# EasyEDA Pro project InOut Counter.eprj

# Schematic MainBoard
Board Name: PCB2; Create Date: 2026-01-17; Page Name: P1; Project Name: InOut Counter; Schematic Name: MainBoard; Update Date: 2026-01-24; Company: EasyEDA.com; Page Size: A4; Version: V1.0
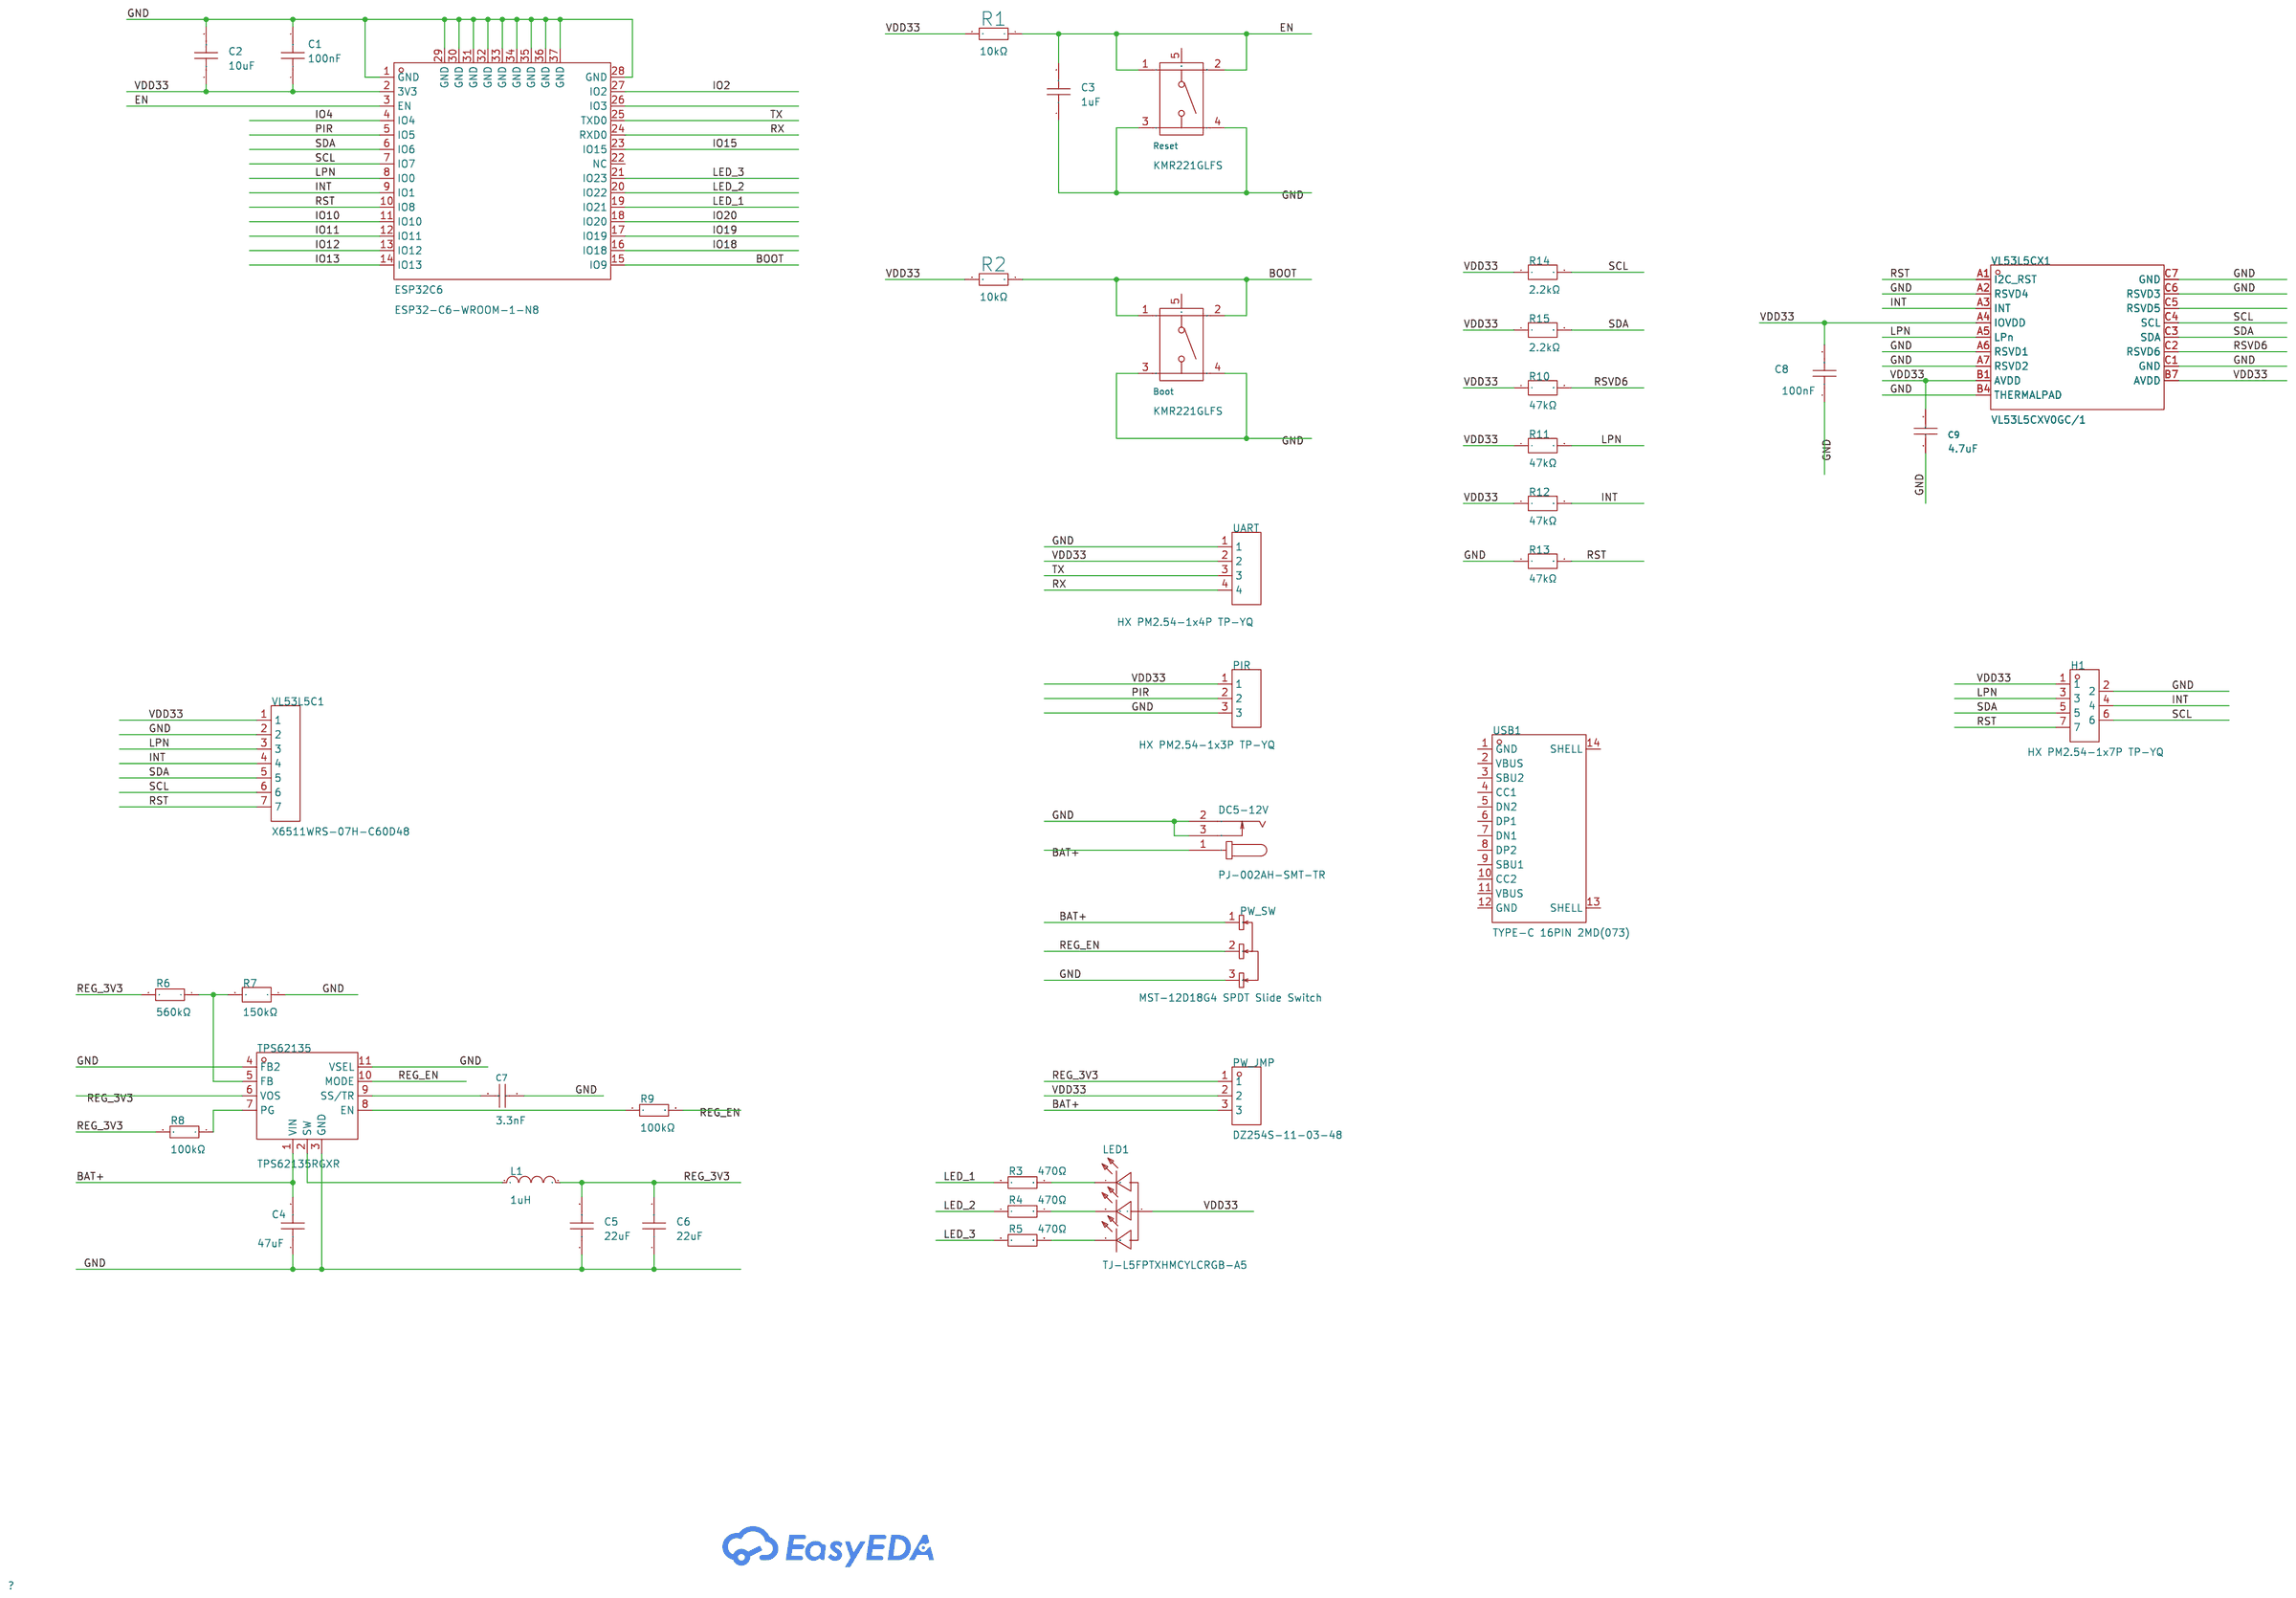
[diagram p0: schematic sheet]

## Parts
Boot  KMR221GLFS  [KEY-SMD_KMR2XXGXXX]
C1  100nF  [C0603]
C2  10uF  [C0603]
C3  1uF  [C0603]
C4  47uF  [C1206]
C5  22uF  [C0603]
C6  22uF  [C0603]
C7  3.3nF  [C0603]
C8  100nF  [C0603]
C9  4.7uF  [C0603]
DC5-12V  PJ-002AH-SMT-TR  [DC-IN-TH_PJ-002AH-SMT-TR]
ESP32C6  ESP32-C6-WROOM-1-N8  [WIRELM-SMD_ESP32-C6-WROOM-1]
H1  HX PM2.54-1x7P TP-YQ  [HDR-SMD_7P-P2.54_HX-PM2.54-1X7P-TP-YQ]
L1  1uH  [IND-SMD_L2.5-W2.0-VLS252012CX-150M]
LED1  TJ-L5FPTXHMCYLCRGB-A5  [LED-TH_4P-BD5.8-P1.30]
PIR  HX PM2.54-1x3P TP-YQ  [HDR-SMD_3P-P2.54-V-F_C9900045551]
PW_JMP  DZ254S-11-03-48  [HDR-TH_3P-P2.54_DZ254S-11-03-48]
PW_SW  MST-12D18G4 SPDT Slide Switch  [SW-SMD_MST-12D18G4-SPDT-SLIDE-SWITCH]
R1  10kΩ  [R0603]
R2  10kΩ  [R0603]
R3  470Ω  [R0603]
R4  470Ω  [R0603]
R5  470Ω  [R0603]
R6  560kΩ  [R0603]
R7  150kΩ  [R0603]
R8  100kΩ  [R0603]
R9  100kΩ  [R0603]
R10  47kΩ  [R0603]
R11  47kΩ  [R0603]
R12  47kΩ  [R0603]
R13  47kΩ  [R0603]
R14  2.2kΩ  [R0603]
R15  2.2kΩ  [R0603]
Reset  KMR221GLFS  [KEY-SMD_KMR2XXGXXX]
TPS62135  TPS62135RGXR  [VQFN-HR-11_L3.0-W2.0-P0.50_TPS62135RGXR]
UART  HX PM2.54-1x4P TP-YQ  [HDR-SMD_HX-PM2.54-1X4P-TP-YQ]
USB1  TYPE-C 16PIN 2MD(073)  [USB-C-SMD_TYPE-C-6PIN-2MD-073]
VL53L5C1  X6511WRS-07H-C60D48  [HDR-SMD_7P-P2.54-H-M-W13.3-N]
VL53L5CX1  VL53L5CXV0GC/1  [LGA-16_L6.4-W3.0_VL53L5CXV0GC-1]

## Library data of the parts
Boot Reset = KMR221GLFS: LCSC Part Name: 4.6*2.8*1.9mm 立贴 轻触开关; Supplier Part: C72443; Manufacturer: C&K; Supplier Footprint: SMD; JLCPCB Part Class: Extended Part; Datasheet: https://atta.szlcsc.com/upload/public/pdf/source/20181012/C265019_000848423B8E84768868498C37CC451B.pdf; Supplier: LCSC; Circuit: SPST; Actuator Style: Round Button; Operating Force: 200gf; Mounting Style: Brick nogging; Switch Length: 4.6mm; Switch Width: 2.8mm; Switch Height: 1.9mm; Contact Current: 50mA; Voltage Rating (DC): 32V; Pin Style: Gull Wing; Operating Temperature: -40℃~+85℃
C1 C8 = TCC0603X7R104K500CT: LCSC Part Name: 100nF ±10% 50V; Supplier Part: C282519; Manufacturer: CCTC(三环); Supplier Footprint: 0603; JLCPCB Part Class: Extended Part; Datasheet: https://item.szlcsc.com/datasheet/TCC0603X7R104K500CT/268639.html; Supplier: LCSC; Tolerance: ±10%; Voltage Rating: 50V; Temperature Coefficient: X7R
C2 = CL10A106MQ8NNNC: LCSC Part Name: 10uF ±20% 6.3V; Supplier Part: C1691; Manufacturer: SAMSUNG(三星); Supplier Footprint: 0603; JLCPCB Part Class: Extended Part; Datasheet: https://item.szlcsc.com/datasheet/CL10A106MQ8NNNC/2043.html; Supplier: LCSC; Tolerance: ±20%; Voltage Rating: 6.3V; Temperature Coefficient: X5R
C3 = CGA0603X5R105K500JT: LCSC Part Name: 1uF ±10% 50V; Supplier Part: C6119852; Manufacturer: HRE(芯声); Supplier Footprint: 0603; JLCPCB Part Class: Extended Part; Datasheet: https://item.szlcsc.com/datasheet/CGA0603X5R105K500JT/7062558.html; Supplier: LCSC; Tolerance: ±10%; Voltage Rating: 50V; Temperature Coefficient: X5R
C4 = GRM31CR61E476ME44L: LCSC Part Name: 47uF ±20% 25V; Supplier Part: C403725; Manufacturer: muRata(村田); Supplier Footprint: 1206; JLCPCB Part Class: Extended Part; Datasheet: https://item.szlcsc.com/datasheet/GRM31CR61E476ME44L/389810.html; Supplier: LCSC; Tolerance: ±20%; Voltage Rating: 25V; Temperature Coefficient: X5R
C5 C6 = CL10A226MQ8NRNC: LCSC Part Name: 22uF ±20% 6.3V; Supplier Part: C59461; Manufacturer: SAMSUNG(三星); Supplier Footprint: 0603; JLCPCB Part Class: Basic Part; Datasheet: https://item.szlcsc.com/datasheet/CL10A226MQ8NRNC/60514.html; Supplier: LCSC; Tolerance: ±20%; Voltage Rating: 6.3V; Temperature Coefficient: X5R
C7 = CC0603KRX7R9BB332: LCSC Part Name: 3.3nF ±10% 50V; Supplier Part: C107088; Manufacturer: YAGEO(国巨); Supplier Footprint: 0603; JLCPCB Part Class: Extended Part; Datasheet: https://item.szlcsc.com/datasheet/CC0603KRX7R9BB332/108304.html; Supplier: LCSC; Tolerance: ±10%; Voltage Rating: 50V; Temperature Coefficient: X7R
C9 = CL10A475KP8NNNC: LCSC Part Name: 4.7uF ±10% 10V; Supplier Part: C1705; Manufacturer: SAMSUNG(三星); Supplier Footprint: 0603; JLCPCB Part Class: Extended Part; Datasheet: https://item.szlcsc.com/datasheet/CL10A475KP8NNNC/2057.html; Supplier: LCSC; Tolerance: ±10%; Voltage Rating: 10V; Temperature Coefficient: X5R
DC5-12V = PJ-002AH-SMT-TR_C22434687: Supplier Part: C22434687; Manufacturer: CUI; Supplier Footprint: SMD; JLCPCB Part Class: Extended Part; Datasheet: https://atta.szlcsc.com/upload/public/pdf/source/20240806/E75BFBA62D498CDF6E8300B1DA029BA5.pdf; Supplier: LCSC
ESP32C6 = ESP32-C6-WROOM-1-N8: Supplier Part: C5366877; Manufacturer: ESPRESSIF(乐鑫); JLCPCB Part Class: Extended Part; Datasheet: https://item.szlcsc.com/datasheet/ESP32-C6-WROOM-1-N8/6203223.html; Supplier: LCSC
H1 = HX PM2.54-1x7P TP-YQ: LCSC Part Name: 1x7P 间距:2.54mm 立贴; Supplier Part: C42379199; Manufacturer: hanxia(韩下); Supplier Footprint: SMD,P=2.54mm(交错脚); JLCPCB Part Class: Extended Part; Datasheet: https://item.szlcsc.com/datasheet/HX%2520PM2.54-1x7P%2520TP-YQ/44285228.html; Supplier: LCSC; Holes Structure: 1x7P; Pitch: 2.54mm; Circular Hole / Square Hole: Square Hole; Mounting Type: Surface Mount,Vertical; Number of Rows: 1; Number of Positions: 7P; Current Rating: 3A; Voltage Rating (Max): 1kV; Holes Direction: Top; Insulation Height: 5mm; Contact Material: Brass; Contact Plating: Gold; Operating Temperature: -40℃~+105℃
L1 = VLS252012HBX-1R0M-1: LCSC Part Name: 1uH ±20% 3A; Supplier Part: C360732; Manufacturer: TDK; Supplier Footprint: 1008; JLCPCB Part Class: Extended Part; Datasheet: https://item.szlcsc.com/datasheet/VLS252012HBX-1R0M-1/335519.html; Supplier: LCSC; Tolerance: ±20%; Current Rating: 3A; Current - Saturation(Isat): 3A; DC Resistance(DCR): 47mΩ
LED1 = TJ-L5FPTXHMCYLCRGB-A5: Diode Configuration:Common Anode Wavelength - Dominant:B:460nm~470nm；G:515nm~530nm；R:620nm~630nm Peak Wavelength:R:620nm；G:520nm；B:465nm Luminous Intensity:R:100mcd~200mcd；B:100mcd~200mcd；G:400mcd~600mcd Lens Color:White Frosted Lens Forward Current:20mA; LCSC Part Name: 5MM平头共阳雾状RGB; Supplier Part: C20613339; Manufacturer: TOGIALED(统佳); Supplier Footprint: 插件; JLCPCB Part Class: Extended Part; Datasheet: https://item.szlcsc.com/datasheet/TJ-L5FPTXHMCYLCRGB-A5/21974274.html; Supplier: LCSC; Diode Configuration: Common Anode; Wavelength - Dominant: B:460nm~470nm；G:515nm~530nm；R:620nm~630nm; Peak Wavelength: R:620nm；G:520nm；B:465nm; Luminous Intensity: R:100mcd~200mcd；B:100mcd~200mcd；G:400mcd~600mcd; Lens Color: White Frosted Lens; Forward Current: 20mA; Forward Voltage(Vf): B:2.8V~3.6V；R:1.8V~2.6V；G:2.8V~3.6V; Power(Watts): 184mW; Operating Temperature: -20℃~+80℃; Lamp Holder Type: 5 mm flat-head LED; Pitch: 1.3mm
PIR = HX PM2.54-1x3P TP-YQ: LCSC Part Name: 1x3P 间距:2.54mm 立贴; Supplier Part: C42379196; Manufacturer: hanxia(韩下); Supplier Footprint: SMD,P=2.54mm(交错脚); JLCPCB Part Class: Extended Part; Datasheet: https://item.szlcsc.com/datasheet/HX%2520PM2.54-1x3P%2520TP-YQ/44285225.html; Supplier: LCSC; Holes Structure: 1x3P; Pitch: 2.54mm; Circular Hole / Square Hole: Square Hole; Mounting Type: Surface Mount,Vertical; Number of Rows: 1; Number of Positions: 3P; Current Rating: 3A; Voltage Rating (Max): 1kV; Holes Direction: Top; Insulation Height: 5mm; Contact Material: Brass; Contact Plating: Gold; Operating Temperature: -40℃~+105℃
PW_JMP = DZ254S-11-03-48: LCSC Part Name: 1x3P 间距:2.54mm 方针 立贴; Supplier Part: C5160786; Manufacturer: DEALON(德艺隆); Supplier Footprint: SMD,P=2.54mm(交错脚); JLCPCB Part Class: Extended Part; Datasheet: https://item.szlcsc.com/datasheet/DZ254S-11-03-48/5807882.html; Supplier: LCSC; Pin Structure: 1x3P; Pitch: 2.54mm; Circluar Pins/Square Pins: Pin Header; Mounting Type: Surface Mount,Vertical; Number of Rows: 1; Number of Pins: 3P; Current Rating: 3A; Length of Mating Pin: 6mm; Insulation Height: 2.54mm; Contact Material: Brass; Contact Plating: Gold; Color: Black
PW_SW = MST-12D18G4 SPDT Slide Switch: LCSC Part Name: MST-12D18G4卧式带柱编带; Supplier Part: C49023767; Manufacturer: SHOU HAN(首韩); Supplier Footprint: SMD; JLCPCB Part Class: Extended Part; Datasheet: https://item.szlcsc.com/datasheet/MST-12D18G4%2520SPDT%2520Slide%2520Switch/51384142.html; Supplier: LCSC; Circuit: SPDT; Actuator Style: Rectangular Columnar; Termination Style: SMD(SMT) Tab; Length: 9.1mm; Width: 3.5mm; Switch Height: 7.5mm; Mounting Type: Surface Mount, Right Angle; Actuator Color: Black; Current Rating: 100mA; Voltage Rating: 12V; Life: 10,000 Cycles; Operating Temperature: -25℃~+70℃
R1 R2 = 0603WAF1002T5E: LCSC Part Name: 厚膜电阻 10kΩ ±1% 100mW; Supplier Part: C25804; Manufacturer: UNI-ROYAL(厚声); Supplier Footprint: 0603; JLCPCB Part Class: Basic Part; Datasheet: https://item.szlcsc.com/datasheet/0603WAF1002T5E/26547.html; Supplier: LCSC; Type: Thick Film Resistor; Tolerance: ±1%; Power(Watts): 100mW; Voltage-Supply(Max): 75V; Temperature Coefficient: ±100ppm/℃; Operating Temperature: -55℃~+155℃
R3-R5 = 0603WAF4700T5E: LCSC Part Name: 470Ω ±1% 100mW 厚膜电阻; Supplier Part: C23179; Manufacturer: UNI-ROYAL(厚声); Supplier Footprint: 0603; JLCPCB Part Class: Basic Part; Datasheet: https://item.szlcsc.com/datasheet/0603WAF4700T5E/23906.html; Supplier: LCSC; Type: Thick Film Resistor; Tolerance: ±1%; Power(Watts): 100mW; Voltage-Supply(Max): 75V; Temperature Coefficient: ±100ppm/℃; Operating Temperature: -55℃~+155℃
R6 = 0603WAF5603T5E: LCSC Part Name: 560kΩ ±1% 100mW 厚膜电阻; Supplier Part: C23203; Manufacturer: UNI-ROYAL(厚声); Supplier Footprint: 0603; JLCPCB Part Class: Extended Part; Datasheet: https://item.szlcsc.com/datasheet/0603WAF5603T5E/23930.html; Supplier: LCSC; Type: Thick Film Resistor; Tolerance: ±1%; Power(Watts): 100mW; Voltage-Supply(Max): 75V; Temperature Coefficient: ±100ppm/℃; Operating Temperature: -55℃~+155℃
R7 = FRC0603F1503TS: LCSC Part Name: 150kΩ ±1% 100mW 厚膜电阻; Supplier Part: C2906993; Manufacturer: FOJAN(富捷); Supplier Footprint: 0603; JLCPCB Part Class: Extended Part; Supplier: LCSC; Type: Thick Film Resistor; Tolerance: ±1%; Power(Watts): 100mW; Voltage-Supply(Max): 75V; Temperature Coefficient: ±100ppm/℃; Operating Temperature: -55℃~+155℃
R8 R9 = 0603WAF1003T5E: LCSC Part Name: 100kΩ ±1% 100mW 厚膜电阻; Supplier Part: C25803; Manufacturer: UNI-ROYAL(厚声); Supplier Footprint: 0603; JLCPCB Part Class: Basic Part; Datasheet: https://item.szlcsc.com/datasheet/0603WAF1003T5E/26546.html; Supplier: LCSC; Type: Thick Film Resistor; Tolerance: ±1%; Power(Watts): 100mW; Voltage-Supply(Max): 75V; Temperature Coefficient: ±100ppm/℃; Operating Temperature: -55℃~+155℃
R10-R13 = FRC0603F4702TS: LCSC Part Name: 47kΩ ±1% 100mW 厚膜电阻; Supplier Part: C2907042; Manufacturer: FOJAN(富捷); Supplier Footprint: 0603; JLCPCB Part Class: Extended Part; Supplier: LCSC; Type: Thick Film Resistor; Tolerance: ±1%; Power(Watts): 100mW; Voltage-Supply(Max): 75V; Temperature Coefficient: ±100ppm/℃; Operating Temperature: -55℃~+155℃
R14 R15 = FRC0603J222 TS: LCSC Part Name: 2.2kΩ ±5% 100mW 厚膜电阻; Supplier Part: C2907117; Manufacturer: FOJAN(富捷); Supplier Footprint: 0603; JLCPCB Part Class: Extended Part; Supplier: LCSC; Type: Thick Film Resistor; Tolerance: ±5%; Power(Watts): 100mW; Voltage-Supply(Max): 75V; Temperature Coefficient: ±100ppm/℃; Operating Temperature: -55℃~+155℃
TPS62135 = TPS62135RGXR: LCSC Part Name: 高精度3V至17V 4A降压转换器; Supplier Part: C167238; Manufacturer: TI(德州仪器); Supplier Footprint: VQFN-11-HR(2x3); JLCPCB Part Class: Extended Part; Datasheet: https://www.ti.com/cn/lit/gpn/tps62135; Supplier: LCSC; Function: Step-down type; Output Type: Adjustable; Input Voltage: 3V~17V; Output Voltage: 800mV~12V; Output Current: 4A; Switching Frequency: 2.5MHz; Operating Temperature: -40℃~+125℃; Synchronous Rectification: Yes; Number of Outputs: 1; Topology: Step-down; Quiescent Current (Iq): 18uA; Switch tube (built-in/external): Built-in
UART = HX PM2.54-1x4P TP-YQ: LCSC Part Name: 1x4P 间距:2.54mm 立贴; Supplier Part: C42379197; Manufacturer: hanxia(韩下); Supplier Footprint: SMD,P=2.54mm(交错脚); JLCPCB Part Class: Extended Part; Datasheet: https://item.szlcsc.com/datasheet/HX%2520PM2.54-1x4P%2520TP-YQ/44285226.html; Supplier: LCSC; Holes Structure: 1x4P; Pitch: 2.54mm; Circular Hole / Square Hole: Square Hole; Mounting Type: Surface Mount,Vertical; Number of Rows: 1; Number of Positions: 4P; Current Rating: 3A; Voltage Rating (Max): 1kV; Holes Direction: Top; Insulation Height: 5mm; Contact Material: Brass; Contact Plating: Gold; Operating Temperature: -40℃~+105℃
USB1 = TYPE-C 16PIN 2MD(073): LCSC Part Name: 16P卧贴母座; Supplier Part: C2765186; Manufacturer: SHOU HAN(首韩); Supplier Footprint: SMD; JLCPCB Part Class: Extended Part; Datasheet: https://item.szlcsc.com/datasheet/TYPE-C%252016PIN%25202MD(073)/2901843.html; Supplier: LCSC; Connector Type: Type-C; Gender: Female; Mounting Type: Surface Mount, Right Angle; Number of Contacts: 16P; Number of Ports: 1; Current Rating-Power: 3A; Voltage Rating: 5V; Connect-Disconnect Life: 5,000 times; Detection color: Black; Operating Temperature: -25℃~+85℃
VL53L5C1 = X6511WRS-07H-C60D48: LCSC Part Name: 1x7P 间距:2.54mm 方针; Supplier Part: C5242200; Manufacturer: XKB Connection(中国星坤); Supplier Footprint: SMD,P=2.54mm; JLCPCB Part Class: Extended Part; Datasheet: https://atta.szlcsc.com/upload/public/pdf/source/20221103/EADF72CF36CD96D511D8188ACEE72315.pdf; Supplier: LCSC; Pin Structure: 1x7P; Pitch: 2.54mm; Row Spacing: 2.54mm; Circluar Pins/Square Pins: Policy; Number of Rows: Single Row; Number of Pins: 7P; Current Rating: 3A; Voltage Rating (Max): 250V; Insulation Height: 2.5mm; Contact Material: Brass; Contact Plating: Gold; Operating Temperature: -40℃~+105℃; Color: Black
VL53L5CX1 = VL53L5CXV0GC/1: LCSC Part Name: I2C接口的飞行时间多区测距传感器; Supplier Part: C3178303; Manufacturer: ST(意法半导体); Supplier Footprint: SMD,6.4x3mm; JLCPCB Part Class: Extended Part; Datasheet: https://item.szlcsc.com/datasheet/VL53L5CXV0GC%252F1/3740241.html; Supplier: LCSC; Voltage - Supply: 2.8V~3.3V; Linear Range: 4m

## Nets
GND: Boot.3 Boot.4 C1.2 C2.2 C3.1 C4.1 C5.1 C6.1 C7.2 C8.1 C9.1 DC5-12V.2 DC5-12V.3 ESP32C6.1(GND) ESP32C6.28(GND) ESP32C6.29(GND) ESP32C6.30(GND) ESP32C6.31(GND) ESP32C6.32(GND) ESP32C6.33(GND) ESP32C6.34(GND) ESP32C6.35(GND) ESP32C6.36(GND) ESP32C6.37(GND) H1.2 PIR.3 PW_SW.3 R7.1 R13.1 Reset.3 Reset.4 TPS62135.3(GND) TPS62135.4(FB2) TPS62135.11(VSEL) UART.1 VL53L5C1.2 VL53L5CX1.A2(RSVD4) VL53L5CX1.A6(RSVD1) VL53L5CX1.A7(RSVD2) VL53L5CX1.B4(THERMALPAD) VL53L5CX1.C1(GND) VL53L5CX1.C6(RSVD3) VL53L5CX1.C7(GND)
VDD33: C1.1 C2.1 C8.2 C9.2 ESP32C6.2(3V3) H1.1 LED1.1 PIR.1 PW_JMP.2 R1.2 R2.2 R10.1 R11.1 R12.1 R14.1 R15.1 UART.2 VL53L5C1.1 VL53L5CX1.A4(IOVDD) VL53L5CX1.B1(AVDD) VL53L5CX1.B7(AVDD)
BAT+: C4.2 DC5-12V.1 PW_JMP.3 PW_SW.1 TPS62135.1(VIN)
BOOT: Boot.1 Boot.2 ESP32C6.15(IO9) R2.1
EN: C3.2 ESP32C6.3(EN) R1.1 Reset.1 Reset.2
INT: ESP32C6.9(IO1) H1.4 R12.2 VL53L5C1.4 VL53L5CX1.A3(INT)
IO2: ESP32C6.27(IO2)
IO4: ESP32C6.4(IO4)
IO10: ESP32C6.11(IO10)
IO11: ESP32C6.12(IO11)
IO12: ESP32C6.13(IO12)
IO13: ESP32C6.14(IO13)
IO15: ESP32C6.23(IO15)
IO18: ESP32C6.16(IO18)
IO19: ESP32C6.17(IO19)
IO20: ESP32C6.18(IO20)
LED_1: ESP32C6.19(IO21) R3.1
LED_2: ESP32C6.20(IO22) R4.1
LED_3: ESP32C6.21(IO23) R5.1
LPN: ESP32C6.8(IO0) H1.3 R11.2 VL53L5C1.3 VL53L5CX1.A5(LPn)
PIR: ESP32C6.5(IO5) PIR.2
REG_3V3: C5.2 C6.2 L1.2 PW_JMP.1 R6.2 R8.2 TPS62135.6(VOS)
REG_EN: PW_SW.2 R9.2 TPS62135.10(MODE)
RST: ESP32C6.10(IO8) H1.7 R13.2 VL53L5C1.7 VL53L5CX1.A1(I2C_RST)
RSVD6: R10.2 VL53L5CX1.C2(RSVD6)
RX: ESP32C6.24(RXD0) UART.4
SCL: ESP32C6.7(IO7) H1.6 R14.2 VL53L5C1.6 VL53L5CX1.C4(SCL)
SDA: ESP32C6.6(IO6) H1.5 R15.2 VL53L5C1.5 VL53L5CX1.C3(SDA)
TX: ESP32C6.25(TXD0) UART.3
$1N2759: L1.1 TPS62135.2(SW)
$1N2973: R8.1 TPS62135.7(PG)
$1N3037: R9.1 TPS62135.8(EN)
$1N3194: R6.1 R7.2 TPS62135.5(FB)
$1N3307: C7.1 TPS62135.9(SS/TR)
$1N5772: LED1.4(R) R3.2
$1N5776: LED1.3(G) R4.2
$1N5784: LED1.2(B) R5.2

Not connected (* = marked no-connect by the designer): Boot 5; ESP32C6 22(NC) 26(IO3); Reset 5; USB1 1(GND) 2(VBUS) 3(SBU2) 4(CC1) 5(DN2) 6(DP1) 7(DN1) 8(DP2) 9(SBU1) 10(CC2) 11(VBUS) 12(GND) 13(SHELL) 14(SHELL); VL53L5CX1 C5(RSVD5)

# Schematic DaughterBoard
Board Name: Board1; Create Date: 2026-01-23; Page Name: P1; Project Name: InOut Counter; Schematic Name: DaughterBoard; Update Date: 2026-01-23; Company: EasyEDA.com; Page Size: A4; Version: V1.0
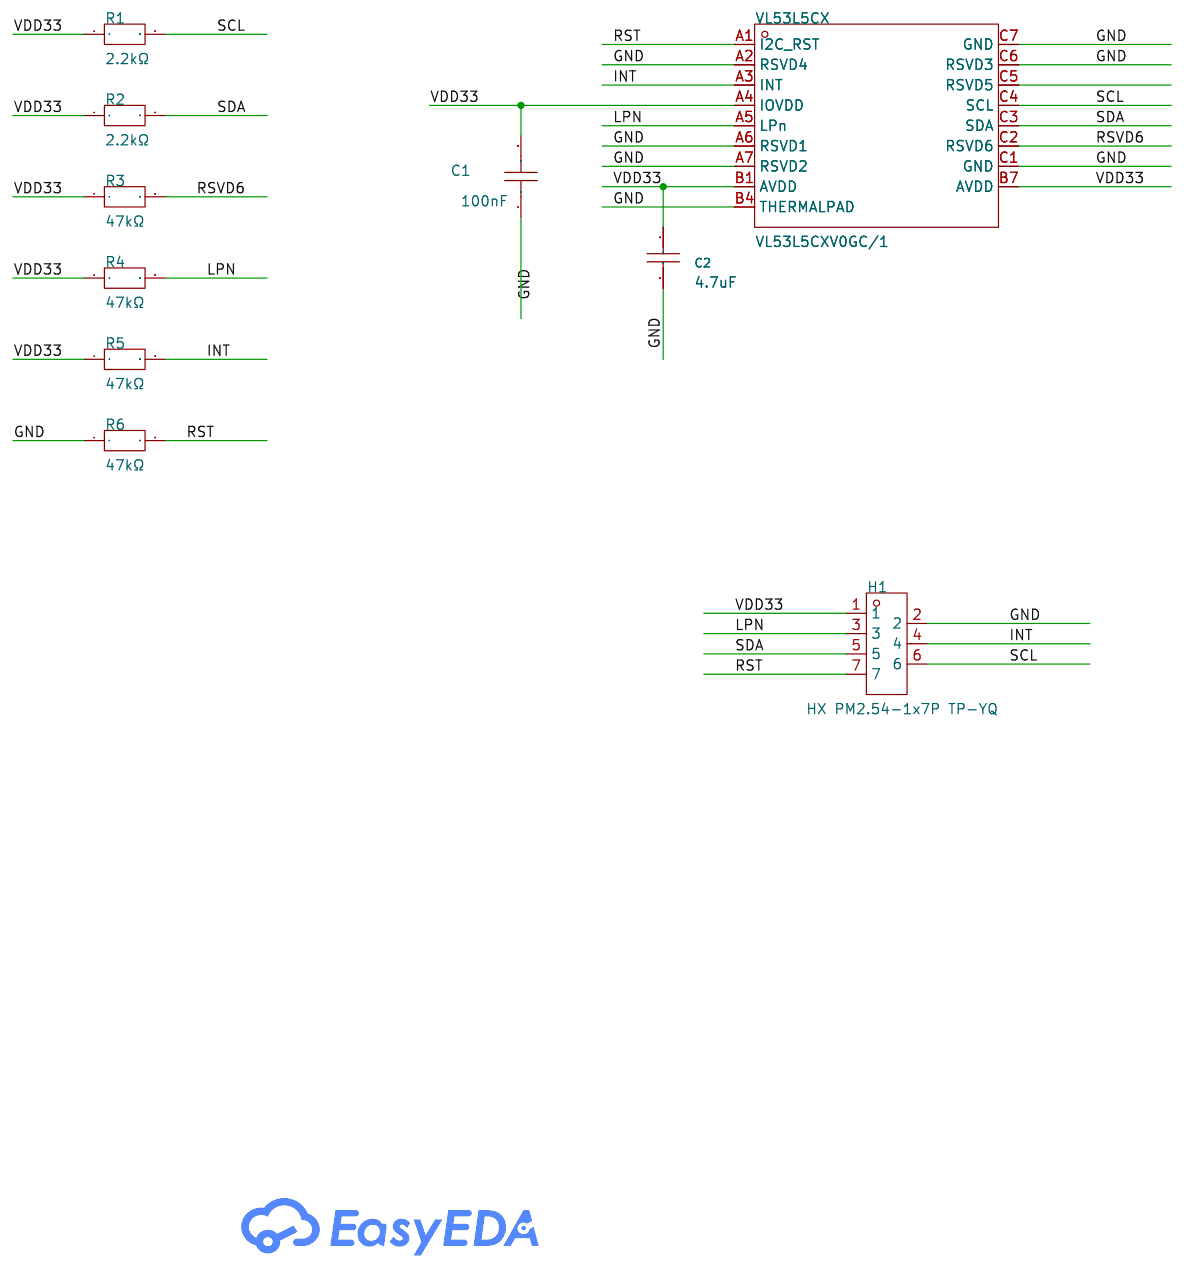
[diagram p1: schematic sheet]

## Parts
C1  100nF  [C0603]
C2  4.7uF  [C0603]
H1  HX PM2.54-1x7P TP-YQ  [HDR-SMD_7P-P2.54_HX-PM2.54-1X7P-TP-YQ]
R1  2.2kΩ  [R0603]
R2  2.2kΩ  [R0603]
R3  47kΩ  [R0603]
R4  47kΩ  [R0603]
R5  47kΩ  [R0603]
R6  47kΩ  [R0603]
VL53L5CX  VL53L5CXV0GC/1  [LGA-16_L6.4-W3.0_VL53L5CXV0GC-1]

## Library data of the parts
C1 = TCC0603X7R104K500CT: LCSC Part Name: 100nF ±10% 50V; Supplier Part: C282519; Manufacturer: CCTC(三环); Supplier Footprint: 0603; JLCPCB Part Class: Extended Part; Datasheet: https://item.szlcsc.com/datasheet/TCC0603X7R104K500CT/268639.html; Supplier: LCSC; Tolerance: ±10%; Voltage Rating: 50V; Temperature Coefficient: X7R
C2 = CL10A475KP8NNNC: LCSC Part Name: 4.7uF ±10% 10V; Supplier Part: C1705; Manufacturer: SAMSUNG(三星); Supplier Footprint: 0603; JLCPCB Part Class: Extended Part; Datasheet: https://item.szlcsc.com/datasheet/CL10A475KP8NNNC/2057.html; Supplier: LCSC; Tolerance: ±10%; Voltage Rating: 10V; Temperature Coefficient: X5R
H1 = HX PM2.54-1x7P TP-YQ: LCSC Part Name: 1x7P 间距:2.54mm 立贴; Supplier Part: C42379199; Manufacturer: hanxia(韩下); Supplier Footprint: SMD,P=2.54mm(交错脚); JLCPCB Part Class: Extended Part; Datasheet: https://item.szlcsc.com/datasheet/HX%2520PM2.54-1x7P%2520TP-YQ/44285228.html; Supplier: LCSC; Holes Structure: 1x7P; Pitch: 2.54mm; Circular Hole / Square Hole: Square Hole; Mounting Type: Surface Mount,Vertical; Number of Rows: 1; Number of Positions: 7P; Current Rating: 3A; Voltage Rating (Max): 1kV; Holes Direction: Top; Insulation Height: 5mm; Contact Material: Brass; Contact Plating: Gold; Operating Temperature: -40℃~+105℃
R1 R2 = FRC0603J222 TS: LCSC Part Name: 2.2kΩ ±5% 100mW 厚膜电阻; Supplier Part: C2907117; Manufacturer: FOJAN(富捷); Supplier Footprint: 0603; JLCPCB Part Class: Extended Part; Supplier: LCSC; Type: Thick Film Resistor; Tolerance: ±5%; Power(Watts): 100mW; Voltage-Supply(Max): 75V; Temperature Coefficient: ±100ppm/℃; Operating Temperature: -55℃~+155℃
R3-R6 = FRC0603F4702TS: LCSC Part Name: 47kΩ ±1% 100mW 厚膜电阻; Supplier Part: C2907042; Manufacturer: FOJAN(富捷); Supplier Footprint: 0603; JLCPCB Part Class: Extended Part; Supplier: LCSC; Type: Thick Film Resistor; Tolerance: ±1%; Power(Watts): 100mW; Voltage-Supply(Max): 75V; Temperature Coefficient: ±100ppm/℃; Operating Temperature: -55℃~+155℃
VL53L5CX = VL53L5CXV0GC/1: LCSC Part Name: I2C接口的飞行时间多区测距传感器; Supplier Part: C3178303; Manufacturer: ST(意法半导体); Supplier Footprint: SMD,6.4x3mm; JLCPCB Part Class: Extended Part; Datasheet: https://item.szlcsc.com/datasheet/VL53L5CXV0GC%252F1/3740241.html; Supplier: LCSC; Voltage - Supply: 2.8V~3.3V; Linear Range: 4m

## Nets
GND: C1.1 C2.1 H1.2 R6.1 VL53L5CX.A2(RSVD4) VL53L5CX.A6(RSVD1) VL53L5CX.A7(RSVD2) VL53L5CX.B4(THERMALPAD) VL53L5CX.C1(GND) VL53L5CX.C6(RSVD3) VL53L5CX.C7(GND)
VDD33: C1.2 C2.2 H1.1 R1.1 R2.1 R3.1 R4.1 R5.1 VL53L5CX.A4(IOVDD) VL53L5CX.B1(AVDD) VL53L5CX.B7(AVDD)
INT: H1.4 R5.2 VL53L5CX.A3(INT)
LPN: H1.3 R4.2 VL53L5CX.A5(LPn)
RST: H1.7 R6.2 VL53L5CX.A1(I2C_RST)
RSVD6: R3.2 VL53L5CX.C2(RSVD6)
SCL: H1.6 R1.2 VL53L5CX.C4(SCL)
SDA: H1.5 R2.2 VL53L5CX.C3(SDA)

Not connected (* = marked no-connect by the designer): VL53L5CX C5(RSVD5)

# Board PCB1
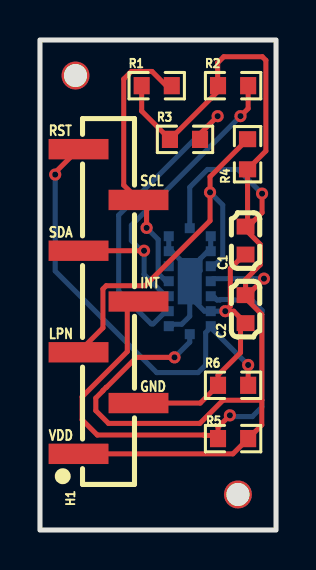
[diagram p2: board, top side]
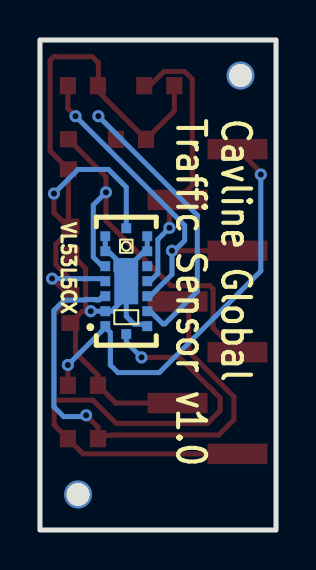
[diagram p3: board, bottom side, seen from below]

Outline 11.81 x 24.51 mm; copper layers: Top Layer, Bottom Layer. Coordinates in mm from the lower left corner of the outline.
Outline path: rectangle 0,24.51 11.81,0
Stack: Top Layer 0.035mm / Dielectric1 1.51mm FR4 er 4.5 / Bottom Layer 0.035mm

## Design rules (mm)
template: JLCPCB Capability(Two Layers Board)
spacing copperThickness1oz (default): track to track 0.102, other pairs 0.152 to 0.3
spacing copperThickness2oz: track to track 0.203, other pairs 0.152 to 0.3
track width copperThickness1oz (default): min 0.127, default 0.254, max 2.54
track width copperThickness2oz: min 0.203, default 0.254, max 2.54
differential pair differentialPair (default): width min 0.127, default 0.254, max 2.54; gap min 0.152, default 0.152
via viaSize (default): diameter min 0.5, default 0.61, max 10; hole min 0.3, default 0.305, max 6.3

## Placement (name value [footprint] x y rotation side)
C1  100nF  [C0603]  10.29 14.48 90 top
C2  4.7uF  [C0603]  10.29 11.05 90 top
H1  HX PM2.54-1x7P TP-YQ  [HDR-SMD_7P-P2.54_HX-PM2.54-1X7P-TP-YQ]  3.43 11.43 90 top
NOREF  -  [Pad_e10]  9.91 1.78 0 top
NOREF#2  -  [Pad_e0]  1.78 22.73 0 top
R1  2.2kΩ  [R0603]  5.84 22.22 0 top
R2  2.2kΩ  [R0603]  9.66 22.22 0 top
R3  47kΩ  [R0603]  7.26 19.54 0 top
R4  47kΩ  [R0603]  10.39 18.8 90 top
R5  47kΩ  [R0603]  9.66 4.57 180 top
R6  47kΩ  [R0603]  9.66 7.24 0 top
VL53L5CX  VL53L5CXV0GC/1  [LGA-16_L6.4-W3.0_VL53L5CXV0GC-1]  7.49 12.45 270 bottom

## Footprints (pads in the part's own frame, mm; a bottom-side part is the same pattern mirrored in y, then rotated)
C0603
  rect 0.8x0.9 smd: 1(-0.7,0) 2(0.7,0)
HDR-SMD_7P-P2.54_HX-PM2.54-1X7P-TP-YQ
  rect 1.02x3 smd: 1(-7.62,1.5) 2(-5.08,-1.5) 3(-2.54,1.5) 4(0,-1.5) 5(2.54,1.5) 6(5.08,-1.5) 7(7.62,1.5)
LGA-16_L6.4-W3.0_VL53L5CXV0GC-1
  rect 0.5x0.5 smd: A1(2.25,-1.05) A2(1.5,-1.05) A3(0.75,-1.05) A4(0,-1.05) A5(-0.75,-1.05) A6(-1.5,-1.05) A7(-2.25,-1.05) B1(2.65,0) B7(-2.65,0) C1(2.25,1.05) C2(1.5,1.05) C3(0.75,1.05) C4(0,1.05) C5(-0.75,1.05) C6(-1.5,1.05) C7(-2.25,1.05)
  rect 2.316x1.2 smd: B4(0,0)
Pad_e0
  round 1.4 hole 1.152: 1(0,0)
Pad_e10
  round 1.4 hole 1.152: 2(0,0)
R0603
  rect 0.806x0.864 smd: 1(-0.753,0) 2(0.753,0)

## Nets
As in the schematic.

Pads without a net: NOREF 2; NOREF#2 1

## Via types
v1: diameter 0.61, hole 0.305, Top Layer to Bottom Layer, 12 vias

## Routing (per net, layer and track width the routed paths; a pad name or vN(x,y) marks a point on that pad's centre or on a via; arc(x,y) is an arc through that point)
GND: length 23.2
  Top Layer w0.254: H1.2 8.02,6.35 8.91,7.24 8.91,7.75 10.03,8.87 10.03,10.09 C2.1 9.69,10.95 v1(9.27,10.95) 9.53,11.2 9.53,13.08 10.22,13.78 C1.1
  Bottom Layer w0.254: VL53L5CX.B4 8.01,12.97 8.01,13.56 8.4,13.95 VL53L5CX.A6 VL53L5CX.A7 ; VL53L5CX.B4 7.49,12.9 7.24,13.15 7.24,13.3 6.59,13.95 6.44,13.95 6.44,14.7 ; VL53L5CX.B4 7.49,11.68 ; 7.49,11.68 8.23,10.95 VL53L5CX.A2 v1(9.27,10.95) ; 7.49,11.68 7.49,10.69 7.09,10.29 6.66,10.29 6.57,10.2 6.44,10.2
VDD33: length 68.6
  Top Layer w0.254: C2.2 10.38,11.75 v1(11.21,12.57) ; C2.2 10.29,12.53 11.02,13.26 11.02,14.29 10.29,15.02 C1.2 ; C2.2 10.29,11.59 11.1,10.78 11.1,6.49 ; R1.1 5.09,20.95 R3.1 8.91,21.95 8.91,22.22 8.89,22.24 8.89,23.37 9.2,23.67 11.12,23.67 11.3,23.49 11.3,18.96 R4.1 10.39,15.28 C1.2 ; C1.2 10.42,15.18 11.11,15.88 v1(11.11,16.83) ; 11.1,6.49 9.16,6.49 8,5.33 3.43,5.33 2.79,5.97 2.79,6.6 3.15,6.96 3.15,6.98 3.31,7.14 3.33,7.14 4.83,8.64 v1(6.73,8.64) ; 11.1,6.49 11.1,5.25 R5.1 9.65,3.81 1.93,3.81
  Bottom Layer w0.254: v1(6.73,8.64) 7.49,9.4 VL53L5CX.B1 ; v1(11.21,12.57) 8.67,12.57 VL53L5CX.A4 ; v1(11.11,16.83) 9.91,18.03 8.38,18.03 7.49,17.14 7.49,15.1
INT: length 25.3
  Top Layer w0.254: H1.4 4.7,11.43 4.37,11.1 4.37,8.92 2.11,6.66 2.11,5.51 2.87,4.75 8.2,4.75 8.22,4.73 8.58,4.73 8.66,4.81 8.91,4.81 ; 8.91,4.81 8.91,4.57 ; 8.91,4.81 8.91,5.14 v1(9.5,5.74)
  Bottom Layer w0.254: VL53L5CX.A3 8.61,11.63 8.73,11.63 8.86,11.51 9,11.51 9.03,11.53 9.51,11.53 9.54,11.51 10.59,11.51 11.11,10.99 11.11,6.16 10.63,5.67 9.57,5.67 v1(9.5,5.74)
LPN: length 19.6
  Top Layer w0.254: 1.93,8.89 3.15,10.11 3.15,12.06 3.31,12.22 5.26,12.22 8.51,15.47 v1(8.51,16.89) 8.51,17.67 R4.2
  Bottom Layer w0.254: VL53L5CX.A5 8.69,13.2 9.14,13.65 9.14,16.26 v1(8.51,16.89)
RST: length 22.1
  Top Layer w0.254: v1(0.76,17.78) 0.76,17.88 H1.7 ; R6.2 v1(10.42,8.25)
  Bottom Layer w0.254: v1(10.42,8.25) 8.54,10.13 ; 8.54,10.13 VL53L5CX.A1 ; 8.54,10.13 8.29,9.87 8.29,8.25 7.91,7.87 5.84,7.87 0.76,12.95 v1(0.76,17.78)
RSVD6: length 15.8
  Top Layer w0.254: R3.2 8.01,19.82 v1(8.89,20.7)
  Bottom Layer w0.254: v1(8.89,20.7) 3.94,15.75 3.94,11.94 5.56,10.31 5.66,10.31 6.3,10.95 6.44,10.95
SCL: length 14
  Top Layer w0.254: R1.2 6.32,22.22 5.61,22.94 4.57,22.94 4.19,22.56 4.19,17.25 H1.6 5.33,16.1 v1(5.33,15.11)
  Bottom Layer w0.254: 6.44,12.45 6.3,12.45 5.91,12.83 5.91,14.53 v1(5.33,15.11)
SDA: length 17.2
  Top Layer w0.254: R2.2 10.42,21.08 v1(10.03,20.7) ; H1.5 v1(5.21,13.97)
  Bottom Layer w0.254: v1(10.03,20.7) 4.57,15.24 4.57,14.48 5.08,13.97 v1(5.21,13.97) 5.21,12.79 6.3,11.7 6.44,11.7

## Text on the board
Bottom Silkscreen Layer: Cavline Global / Traffic Sensor v1.0
Top Silkscreen Layer: RST | SDA | LPN | VDD | SCL | INT | GND

# Board PCB2
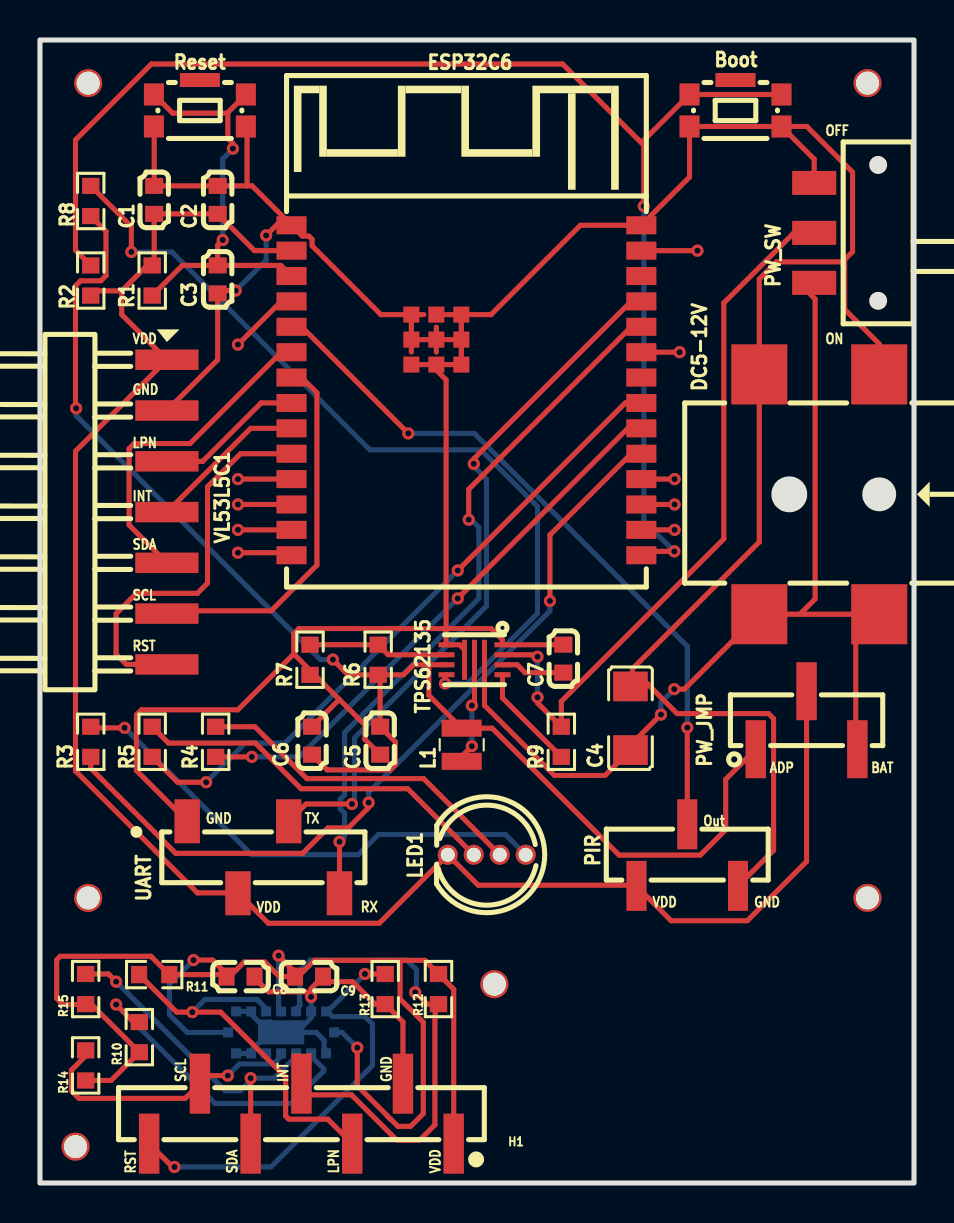
[diagram p4: board, top side]
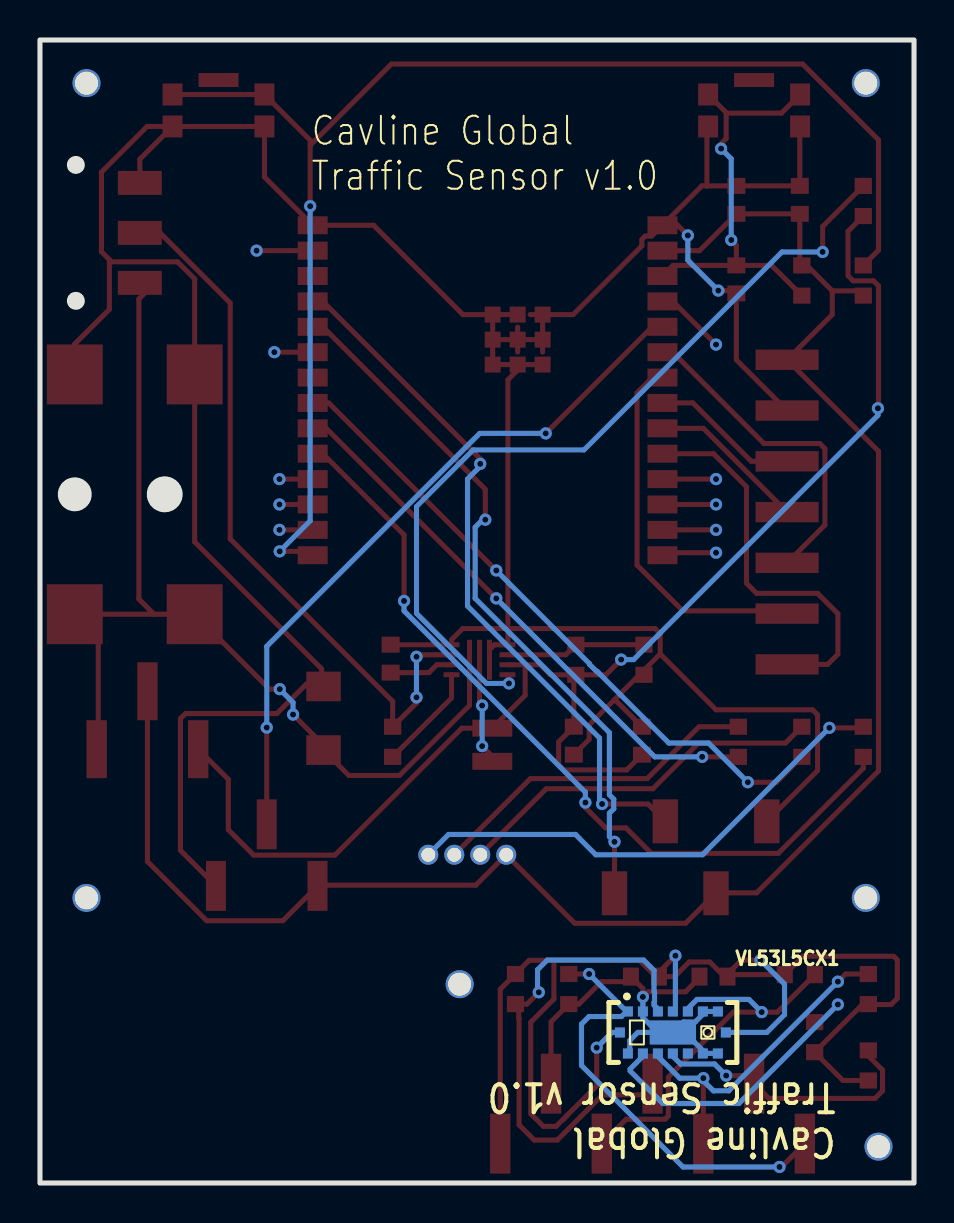
[diagram p5: board, bottom side, seen from below]

Outline 43.73 x 57.19 mm; copper layers: Top Layer, Bottom Layer. Coordinates in mm from the lower left corner of the outline.
Outline path: rectangle 0,57.19 43.73,0
Stack: Top Layer 0.035mm / Dielectric1 1.51mm FR4 er 4.5 / Bottom Layer 0.035mm

## Design rules (mm)
template: JLCPCB Capability(Two Layers Board)
spacing copperThickness1oz (default): track to track 0.102, other pairs 0.152 to 0.3
spacing copperThickness2oz: track to track 0.203, other pairs 0.152 to 0.3
track width copperThickness1oz (default): min 0.127, default 0.254, max 2.54
track width copperThickness2oz: min 0.203, default 0.254, max 2.54
differential pair differentialPair (default): width min 0.127, default 0.254, max 2.54; gap min 0.152, default 0.152
via viaSize (default): diameter min 0.5, default 0.61, max 10; hole min 0.3, default 0.305, max 6.3

## Placement (name value [footprint] x y rotation side)
Boot  KMR221GLFS  [KEY-SMD_KMR2XXGXXX]  34.8 54.03 0 top
C1  100nF  [C0603]  5.72 49.19 90 top
C2  10uF  [C0603]  8.89 49.19 90 top
C3  1uF  [C0603]  8.89 45.21 90 top
C4  47uF  [C1206]  29.54 23.26 270 top
C5  22uF  [C0603]  17.02 22.13 90 top
C6  22uF  [C0603]  13.61 22.13 270 top
C7  3.3nF  [C0603]  26.18 26.24 90 top
C8  100nF  [C0603]  10.03 10.33 180 top
C9  4.7uF  [C0603]  13.46 10.33 180 top
DC5-12V  PJ-002AH-SMT-TR  [DC-IN-TH_PJ-002AH-SMT-TR]  38.99 34.46 180 top
ESP32C6  ESP32-C6-WROOM-1-N8  [WIRELM-SMD_ESP32-C6-WROOM-1]  21.34 39.67 0 top
H1  HX PM2.54-1x7P TP-YQ  [HDR-SMD_7P-P2.54_HX-PM2.54-1X7P-TP-YQ]  13.08 3.47 180 top
L1  1uH  [IND-SMD_L2.5-W2.0-VLS252012CX-150M]  21.1 21.93 90 top
LED1  TJ-L5FPTXHMCYLCRGB-A5  [LED-TH_4P-BD5.8-P1.30]  22.35 16.43 180 top
NOREF  -  [Pad_e36]  41.4 14.27 0 top
NOREF#2  -  [Pad_e31]  41.4 55.03 0 top
NOREF#3  -  [Pad_e259]  22.73 9.95 90 top
NOREF#4  -  [Pad_e35]  2.41 55.03 0 top
NOREF#5  -  [Pad_e37]  2.41 14.27 0 top
NOREF#6  -  [Pad_e258]  1.78 1.82 90 top
PIR  HX PM2.54-1x3P TP-YQ  [HDR-SMD_3P-P2.54-V-F_C9900045551]  32.39 16.41 0 top
PW_JMP  DZ254S-11-03-48  [HDR-TH_3P-P2.54_DZ254S-11-03-48]  38.35 23.16 0 top
PW_SW  MST-12D18G4 SPDT Slide Switch  [SW-SMD_MST-12D18G4-SPDT-SLIDE-SWITCH]  38.74 47.54 90 top
R1  10kΩ  [R0603]  5.61 45.16 90 top
R2  10kΩ  [R0603]  2.54 45.16 270 top
R3  470Ω  [R0603]  2.54 22.08 90 top
R4  470Ω  [R0603]  8.79 22.08 90 top
R5  470Ω  [R0603]  5.61 22.08 90 top
R6  560kΩ  [R0603]  16.92 26.18 270 top
R7  150kΩ  [R0603]  13.51 26.18 90 top
R8  100kΩ  [R0603]  2.54 49.14 270 top
R9  100kΩ  [R0603]  26.08 22.08 90 top
R10  47kΩ  [R0603]  4.97 7.3 90 top
R11  47kΩ  [R0603]  5.72 10.43 180 top
R12  47kΩ  [R0603]  19.94 9.7 270 top
R13  47kΩ  [R0603]  17.27 9.7 90 top
R14  2.2kΩ  [R0603]  2.29 5.88 90 top
R15  2.2kΩ  [R0603]  2.29 9.7 90 top
Reset  KMR221GLFS  [KEY-SMD_KMR2XXGXXX]  8 54.03 0 top
TPS62135  TPS62135RGXR  [VQFN-HR-11_L3.0-W2.0-P0.50_TPS62135RGXR]  21.74 26.18 90 top
UART  HX PM2.54-1x4P TP-YQ  [HDR-SMD_HX-PM2.54-1X4P-TP-YQ]  11.18 16.3 0 top
VL53L5C1  X6511WRS-07H-C60D48  [HDR-SMD_7P-P2.54-H-M-W13.3-N]  6.35 33.57 270 top
VL53L5CX1  VL53L5CXV0GC/1  [LGA-16_L6.4-W3.0_VL53L5CXV0GC-1]  12.06 7.54 0 bottom

## Footprints (pads in the part's own frame, mm; a bottom-side part is the same pattern mirrored in y, then rotated)
C0603
  rect 0.8x0.9 smd: 1(-0.7,0) 2(0.7,0)
C1206
  rect 1.485x1.728 smd: 1(-1.593,0) 2(1.593,0)
DC-IN-TH_PJ-002AH-SMT-TR
  rect 2.8x3 smd: 1(-3,6) 1(3,6) 2(-3,-6) 3(3,-6)
HDR-SMD_3P-P2.54-V-F_C9900045551
  rect 1x2.5 smd: 1(-2.54,-1.54) 2(0,1.54) 3(2.54,-1.54)
HDR-SMD_7P-P2.54-H-M-W13.3-N
  rect 1.02x3.16 smd: 1(-7.62,0) 2(-5.08,0) 3(-2.54,0) 4(0,0) 5(2.54,0) 6(5.08,0) 7(7.62,0)
HDR-SMD_7P-P2.54_HX-PM2.54-1X7P-TP-YQ
  rect 1.02x3 smd: 1(-7.62,1.5) 2(-5.08,-1.5) 3(-2.54,1.5) 4(0,-1.5) 5(2.54,1.5) 6(5.08,-1.5) 7(7.62,1.5)
HDR-SMD_HX-PM2.54-1X4P-TP-YQ
  rect 1.27x2.2 smd: 1(-3.81,1.8) 2(-1.27,-1.8) 3(1.27,1.8) 4(3.81,-1.8)
HDR-TH_3P-P2.54_DZ254S-11-03-48
  rect 1.02x2.9 smd: 1(-2.54,-1.45) 2(0,1.45) 3(2.54,-1.45)
IND-SMD_L2.5-W2.0-VLS252012CX-150M
  rect 0.85x2 smd: 1(-0.83,0) 2(0.83,0)
KEY-SMD_KMR2XXGXXX
  rect 1x1.1 smd: 1(-2.3,0.438) 2(2.3,0.438) 3(-2.3,-1.162) 4(2.3,-1.162)
  rect 2x0.7 smd: 5(0,1.162)
LED-TH_4P-BD5.8-P1.30
  round 1 hole 0.7: 1(1.95,0) 2(0.65,0) 3(-0.65,0) 4(-1.95,0)
LGA-16_L6.4-W3.0_VL53L5CXV0GC-1
  rect 0.5x0.5 smd: A1(2.25,-1.05) A2(1.5,-1.05) A3(0.75,-1.05) A4(0,-1.05) A5(-0.75,-1.05) A6(-1.5,-1.05) A7(-2.25,-1.05) B1(2.65,0) B7(-2.65,0) C1(2.25,1.05) C2(1.5,1.05) C3(0.75,1.05) C4(0,1.05) C5(-0.75,1.05) C6(-1.5,1.05) C7(-2.25,1.05)
  rect 2.316x1.2 smd: B4(0,0)
Pad_e31
  round 1.4 hole 1.152: 1(0,0)
Pad_e35
  round 1.4 hole 1.152: 2(0,0)
Pad_e36
  round 1.4 hole 1.152: 3(0,0)
Pad_e37
  round 1.4 hole 1.152: 4(0,0)
Pad_e258
  round 1.4 hole 1.152: 1(0,0)
Pad_e259
  round 1.4 hole 1.152: 2(0,0)
R0603
  rect 0.806x0.864 smd: 1(-0.753,0) 2(0.753,0)
SW-SMD_MST-12D18G4-SPDT-SLIDE-SWITCH
  rect 1.2x2.2 smd: 1(-2.5,0) 2(0,0) 3(2.5,0)
VQFN-HR-11_L3.0-W2.0-P0.50_TPS62135RGXR
  rect 2x0.25 smd: 1(0,-0.5) 2(0,0) 3(0,0.5)
  rect 0.25x0.8 smd: 4(0.75,1.4) 5(0.25,1.4) 6(-0.25,1.4) 7(-0.75,1.4) 8(-0.75,-1.4) 9(-0.25,-1.4) 10(0.25,-1.4) 11(0.75,-1.4)
WIRELM-SMD_ESP32-C6-WROOM-1
  rect 1.5x0.9 smd: 1(-8.75,8.255) 2(-8.75,6.985) 3(-8.75,5.715) 4(-8.75,4.445) 5(-8.75,3.175) 6(-8.75,1.905) 7(-8.75,0.635) 8(-8.75,-0.635) 9(-8.75,-1.905) 10(-8.75,-3.175) 11(-8.75,-4.445) 12(-8.75,-5.715) 13(-8.75,-6.985) 14(-8.75,-8.255) 15(8.75,-8.255) 16(8.75,-6.985) 17(8.75,-5.715) 18(8.75,-4.445) 19(8.75,-3.175) 20(8.75,-1.905) 21(8.75,-0.635) 22(8.75,0.635) 23(8.75,1.905) 24(8.75,3.175) 25(8.75,4.445) 26(8.75,5.715) 27(8.75,6.985) 28(8.75,8.255)
  rect 0.8x0.8 smd: 29(-2.755,3.785) 30(-1.505,3.785) 31(-0.255,3.785) 32(-0.255,2.535) 33(-1.505,2.535) 34(-2.755,2.535) 35(-2.755,1.285) 36(-1.505,1.285) 37(-0.255,1.285)

## Nets
As in the schematic.

Pads without a net: Boot 5; ESP32C6 22; NOREF 3; NOREF#2 1; NOREF#3 2; NOREF#4 2; NOREF#5 4; NOREF#6 1; Reset 5

## Via types
v1: diameter 0.61, hole 0.305, Top Layer to Bottom Layer, 51 vias

## Routing (per net, layer and track width the routed paths; a pad name or vN(x,y) marks a point on that pad's centre or on a via; arc(x,y) is an arc through that point)
GND: length 210
  Top Layer w0.25: 20.32,27.74 12.95,27.74 12.7,27.49 12.7,26.47 16.25,22.92 16.25,22.2 C5.1 ; 20.32,27.74 22.58,27.74 23.13,27.19 23.13,26.93 26.18,26.93 ; 20.32,27.74 20.32,26.95 TPS62135.4 20.97,26.93 20.98,26.94 21.24,26.68 TPS62135.3 ; 20.32,27.74 20.32,40.19
  Top Layer w0.254: ESP32C6.34 ESP32C6.33 ; ESP32C6.34 ESP32C6.29 ; ESP32C6.34 18.58,41.58 ; H1.2 18.16,8.06 17.27,8.95 16.76,8.95 15.64,10.08 14.42,10.08 C9.1 13.56,9.73 v1(13.56,9.31) 13.31,9.57 11.43,9.57 10.73,10.26 C8.1 ; 29.64,24.97 29.64,25.73 35.99,32.08 DC5-12V.3 35.99,45.23 36.84,46.09 40.15,46.09 40.26,46.2 ; 29.64,24.97 29.64,24.94 C4.1 ; 29.64,24.97 30.4,24.97 31.88,23.49 36.45,23.49 36.7,23.24 36.7,16.65 PIR.3 ; ESP32C6.30 ESP32C6.31 ; 10.36,49.89 10.36,52.8 Reset.4 ; 10.36,49.89 5.72,49.89 5.72,52.85 Reset.3 ; 10.36,49.89 10.62,49.89 12.33,48.18 12.08,48.18 v1(11.32,47.41) ; Boot.4 38.37,52.86 40.65,50.58 40.65,46.6 40.26,46.2 ; Boot.4 38.74,51.23 PW_SW.3 ; Boot.4 Boot.3 32.5,50.33 ESP32C6.28 27.04,47.92 22.57,43.45 ESP32C6.31 ; 12.7,26.47 9.91,23.68 5.08,23.68 4.83,23.43 4.83,20.64 UART.1 ; ESP32C6.36 19.81,40.7 20.32,40.19 ; ESP32C6.36 ESP32C6.37 ESP32C6.32 ; ESP32C6.36 ESP32C6.35 ; 40.26,46.2 40.26,43.71 41.99,41.98 DC5-12V.2 ; 13.72,25.46 13.54,25.46 R7.1 ; ESP32C6.29 17.06,43.45 13.62,46.89 13.62,47.22 13.45,47.38 13.13,47.38 ESP32C6.1 ; ESP32C6.29 19.21,43.45 ; ESP32C6.33 19.83,41.58 ; ESP32C6.33 ESP32C6.32 ; ESP32C6.33 19.83,42.83 ; ESP32C6.31 ESP32C6.32 ; 14.99,24.19 14.97,24.19 C6.1 ; VL53L5C1.2 8.89,41.19 C3.1 9.03,44.65 v1(9.79,44.65)
  Bottom Layer w0.254: VL53L5CX1.B4 12.83,7.54 ; VL53L5CX1.B4 11.62,7.54 11.36,7.28 11.22,7.28 10.56,6.63 VL53L5CX1.C6 VL53L5CX1.C7 ; VL53L5CX1.B4 11.54,8.06 10.95,8.06 10.56,8.44 VL53L5CX1.A6 VL53L5CX1.A7 ; 12.83,7.54 13.82,7.54 14.22,7.13 14.22,6.71 14.31,6.61 VL53L5CX1.C1 ; 12.83,7.54 13.56,8.27 VL53L5CX1.A2 v1(13.56,9.31) ; v1(9.79,44.65) 11.32,46.18 v1(11.32,47.41)
VDD33: length 162
  Top Layer w0.254: 12.76,10.33 12.92,10.33 13.73,11.14 18.02,11.14 ; 12.76,10.33 12.76,10.55 v1(11.94,11.38) ; 12.76,10.33 11.98,10.33 11.25,11.06 10.22,11.06 9.49,10.33 C8.2 ; 9.91,14.52 UART.2 ; 9.91,14.52 7.87,14.52 1.78,20.62 1.78,36.62 VL53L5C1.1 4.09,43.45 4.09,44.64 ; 9.91,14.52 11.43,13 16.97,13 LED1.1 21.93,14.9 29.8,14.9 ; C8.2 9.23,10.43 R11.1 5.55,11.35 1.02,11.35 0.84,11.17 0.84,9.24 1.14,8.93 2.27,8.93 2.29,8.95 2.56,8.95 4.97,6.55 3.56,5.13 R14.1 ; C8.2 9.33,10.46 8.64,11.15 v1(7.68,11.15) ; 18.02,11.14 18.02,9.2 19.18,8.04 19.18,3.47 18.54,2.84 17.91,2.84 17.55,3.19 17.54,3.19 17.37,3.36 17.37,3.37 15.88,4.87 v1(15.88,6.77) ; 18.02,11.14 19.26,11.14 R12.1 20.7,9.7 H1.1 ; ESP32C6.2 10.73,46.65 C2.1 C1.1 5.72,46.01 R1.2 5.36,45.91 4.09,44.64 ; 4.09,44.64 2.78,44.64 2.54,44.4 ; 29.8,14.9 PIR.1 ; 29.8,14.9 31.58,13.12 35.39,13.12 38.35,16.09 PW_JMP.2
  Bottom Layer w0.254: VL53L5CX1.B7 7.37,7.54 6.48,8.42 6.48,9.95 v1(7.68,11.15) ; VL53L5CX1.B1 15.11,7.54 v1(15.88,6.77) ; VL53L5CX1.A4 11.94,8.71 v1(11.94,11.38)
BAT+: length 51.3
  Top Layer w0.25: TPS62135.1 22.24,23.9 25.74,20.39 28.27,20.39 C4.2
  Top Layer w0.254: PW_JMP.3 40.81,21.79 40.81,28.46 ; 38.02,28.46 40.81,28.46 ; 38.02,28.46 DC5-12V.1 32.24,24.71 v1(31.73,24.71) ; 38.02,28.46 38.78,29.22 38.78,44.23 37.97,45.04 ; 40.81,28.46 DC5-12V.1 ; v1(31.07,23.44) 29.54,21.92 C4.2
  Bottom Layer w0.254: v1(31.73,24.71) 31.07,24.05 v1(31.07,23.44)
BOOT: length 69.1
  Top Layer w0.254: 30.21,51.92 30.21,52.18 Boot.1 Boot.2 ; 30.21,51.92 v1(30.21,48.88) ; 30.21,51.92 26.15,55.99 5.57,55.99 1.78,52.19 1.78,46.67 R2.1 ; ESP32C6.15 30.15,31.48 30.59,31.48 30.72,31.61 v1(31.74,31.61)
  Bottom Layer w0.254: v1(31.74,31.61) 30.21,33.13 v1(30.21,48.88)
EN: length 21.2
  Top Layer w0.254: C3.2 8.89,46.93 v1(9.14,47.18) ; C3.2 12.05,45.91 ESP32C6.3 ; C3.2 7.12,45.91 5.61,44.4 ; v1(9.65,51.75) 9.65,52.01 9.4,52.26 9.4,53.53 ; Reset.2 9.4,53.56 9.4,53.53 ; 9.4,53.53 6.63,53.53 Reset.1
  Bottom Layer w0.254: v1(9.14,47.18) 9.14,51.25 v1(9.65,51.75)
INT: length 33.3
  Top Layer w0.254: VL53L5C1.4 10.54,37.76 ESP32C6.9 ; H1.4 13.08,4.74 13.41,4.41 15.59,4.41 17.85,2.15 19,2.15 19.76,2.91 19.76,8.25 19.78,8.26 19.78,8.62 19.7,8.7 19.7,8.95 ; 19.7,8.95 19.37,8.95 v1(18.77,9.54) ; 19.7,8.95 19.94,8.95
  Bottom Layer w0.254: VL53L5CX1.A3 12.88,8.65 12.88,8.78 13.01,8.9 13.01,9.05 12.98,9.07 12.98,9.56 13.01,9.58 13.01,10.63 13.53,11.15 18.35,11.15 18.84,10.67 18.84,9.61 v1(18.77,9.54)
IO2: length 2.8
  Top Layer w0.254: ESP32C6.27 v1(32.89,46.65)
IO4: length 3.6
  Top Layer w0.254: v1(9.91,41.95) 12.06,44.11 12.59,44.11
IO10: length 2.7
  Top Layer w0.254: ESP32C6.11 v1(9.91,35.22)
IO11: length 2.7
  Top Layer w0.254: ESP32C6.12 v1(9.91,33.95)
IO12: length 2.7
  Top Layer w0.254: ESP32C6.13 v1(9.91,32.68)
IO13: length 2.7
  Top Layer w0.254: ESP32C6.14 12.46,31.54 v1(9.91,31.54)
IO15: length 1.9
  Top Layer w0.254: ESP32C6.23 v1(32,41.57)
IO18: length 1.7
  Top Layer w0.254: ESP32C6.16 v1(31.75,32.68)
IO19: length 1.7
  Top Layer w0.254: ESP32C6.17 v1(31.75,33.95)
IO20: length 1.7
  Top Layer w0.254: ESP32C6.18 v1(31.75,35.22)
LED_1: length 40.8
  Top Layer w0.254: ESP32C6.19 29.58,36.49 25.51,32.43 v1(25.51,29.13) ; v1(16.44,19.04) 16.44,18.78 15.43,17.77 14.41,17.77 13.14,16.5 6.79,16.5 2.54,20.75 R3.1
  Bottom Layer w0.254: v1(25.51,29.13) 25.51,28.62 16.44,19.55 v1(16.44,19.04)
LED_2: length 28.1
  Top Layer w0.254: v1(20.9,29.25) 29.41,37.76 ESP32C6.20 ; v1(10.6,21.32) R4.1
  Bottom Layer w0.254: v1(20.9,29.25) 12.97,21.32 v1(10.6,21.32)
LED_3: length 32.9
  Top Layer w0.254: R5.1 6.88,20.05 v1(8.31,20.05) ; ESP32C6.21 29.28,39.03 v1(20.9,30.65)
  Bottom Layer w0.254: v1(8.31,20.05) 10.27,22.01 12.27,22.01 15.86,25.61 15.89,25.61 16.23,25.95 16.23,25.98 v1(20.9,30.65)
LPN: length 27
  Top Layer w0.254: ESP32C6.8 11.06,39.03 8.14,36.11 VL53L5C1.3 ; H1.3 14.4,3.19 12.46,3.19 12.29,3.36 12.29,5.3 9.04,8.55 v1(7.62,8.55) 6.84,8.55 R11.2
  Bottom Layer w0.254: VL53L5CX1.A5 11.31,8.73 10.86,9.19 8.25,9.19 v1(7.62,8.55)
PIR: length 35.3
  Top Layer w0.254: ESP32C6.5 13.09,42.84 v1(18.43,37.51) ; v1(32.39,22.79) PIR.2
  Bottom Layer w0.254: v1(18.43,37.51) 21.73,37.51 32.39,26.85 v1(32.39,22.79)
REG_3V3: length 70
  Top Layer w0.25: 19.46,25.93 TPS62135.6 ; 19.46,25.93 18.69,25.93 18.19,25.43 R6.2 ; 19.46,25.93 19.46,24.4 L1.2
  Top Layer w0.254: v1(14.65,26.19) 15.42,25.43 R6.2 17.02,25.33 C5.2 17.78,22.07 17.78,20.92 17.53,20.67 14.37,20.67 C6.2 ; 35.81,21.71 34.31,20.2 34.31,17.68 33.04,16.41 28.97,16.41 22.62,22.76 L1.2 ; v1(1.81,38.76) 1.78,38.79 1.78,44.89 2.03,45.14 3.05,45.14 3.3,45.4 3.3,47.62 R8.2
  Bottom Layer w0.254: v1(14.65,26.19) 14.03,26.19 1.81,38.41 v1(1.81,38.76)
REG_EN: length 35.6
  Top Layer w0.254: v1(24.89,26.33) 24.79,26.43 TPS62135.10 ; v1(24.89,24.3) 24.89,24.02 R9.2 26.08,24.1 34.21,32.23 34.21,44.03 37.72,47.54 37.97,47.54
  Bottom Layer w0.254: v1(24.89,26.33) v1(24.89,24.3)
RST: length 41.8
  Top Layer w0.254: R13.2 v1(16.26,10.46) ; ESP32C6.10 10.03,36.49 8.38,34.84 8.38,30.01 7.87,29.51 4.83,29.51 3.81,28.49 3.81,26.46 4.32,25.95 VL53L5C1.7 ; v1(6.73,0.8) 6.63,0.8 H1.7
  Bottom Layer w0.254: v1(16.26,10.46) 14.38,8.59 ; 14.38,8.59 14.64,8.33 16.26,8.33 16.64,7.95 16.64,5.88 11.56,0.8 v1(6.73,0.8) ; 14.38,8.59 VL53L5CX1.A1
RSVD6: length 15.8
  Top Layer w0.254: v1(3.81,8.93) 4.69,8.05 R10.2
  Bottom Layer w0.254: VL53L5CX1.C2 13.56,6.34 14.2,5.71 14.2,5.61 12.57,3.98 8.76,3.98 v1(3.81,8.93)
RX: length 35.6
  Top Layer w0.254: v1(14.99,17.07) UART.4 ; ESP32C6.24 29.58,42.84 21.45,34.71 v1(21.45,33.19)
  Bottom Layer w0.254: v1(21.45,33.19) 21.58,33.19 21.96,32.81 21.96,29.25 15.24,22.53 15.24,19.42 15.02,19.21 15.02,18.72 15.24,18.51 15.24,17.33 v1(14.99,17.07)
SCL: length 32.7
  Top Layer w0.254: ESP32C6.7 13.09,40.3 13.86,39.54 13.86,30.92 11.57,28.63 6.49,28.63 VL53L5C1.6 ; R14.2 2.29,6.36 1.58,5.65 1.58,4.61 1.95,4.23 7.26,4.23 H1.6 8.41,5.38 v1(9.4,5.38)
  Bottom Layer w0.254: VL53L5CX1.C4 12.06,6.34 11.68,5.96 9.98,5.96 v1(9.4,5.38)
SDA: length 33.8
  Top Layer w0.254: R15.2 3.43,10.46 v1(3.81,10.08) ; ESP32C6.6 12.08,41.57 7.51,37 4.71,37 4.46,36.75 4.46,32.92 VL53L5C1.5 ; H1.5 v1(10.54,5.25)
  Bottom Layer w0.254: VL53L5CX1.C3 12.81,6.34 11.72,5.25 v1(10.54,5.25) 10.54,5.12 10.03,4.61 9.27,4.61 v1(3.81,10.08)
TX: length 35.5
  Top Layer w0.254: 12.45,18.1 13.31,18.97 v1(15.61,18.97) ; 30.09,44.11 29.58,44.11 21.7,36.24 v1(21.7,35.98)
  Bottom Layer w0.254: v1(21.7,35.98) 21.7,35.86 22.34,35.22 22.34,28.87 15.74,22.27 15.74,19.09 v1(15.61,18.97)
$1N2759: length 5.3
  Top Layer w0.25: TPS62135.2 21.74,24.02 v1(21.61,23.89) ; v1(21.61,21.86) 21.1,21.35 L1.1
  Bottom Layer w0.25: v1(21.61,21.86) v1(21.61,23.89)
$1N2973: length 41.6
  Top Layer w0.25: v1(20.27,25) 20.27,25.36 TPS62135.7 ; v1(4.57,46.59) 4.57,47.86 2.54,49.89
  Bottom Layer w0.25: v1(20.27,25) 21.39,25 24.89,28.5 24.89,33.84 22.06,36.68 16.51,36.68 6.6,46.59 v1(4.57,46.59)
$1N3037: length 5.3
  Top Layer w0.25: TPS62135.8 23.14,24.27 R9.1
$1N3194: length 7
  Top Layer w0.25: TPS62135.5 17.42,26.43 R6.1
  Top Layer w0.254: R6.1 R7.2
$1N3307: length 3.2
  Top Layer w0.254: TPS62135.9 23.88,25.93 24.27,25.54 C7.1
$1N5772: length 25.3
  Top Layer w0.254: R3.2 2.59,22.78 v1(4.24,22.78)
  Bottom Layer w0.254: v1(4.24,22.78) 10.59,16.43 15.92,16.43 16.94,17.44 23.29,17.44 LED1.4
$1N5776: length 16.9
  Top Layer w0.254: LED1.3 19.19,20.24 13.35,20.24 10.75,22.83 R4.2
$1N5784: length 18.7
  Top Layer w0.254: LED1.2 18.4,19.73 13.07,19.73 10.78,22.01 6.43,22.01 R5.2

## Text on the board
Bottom Silkscreen Layer: Cavline Global / Traffic Sensor v1.0
Top Silkscreen Layer: VDD | GND | LPN | INT | SDA | SCL | RST | TX | Out | ADP | OFF | ON | BAT | RX
